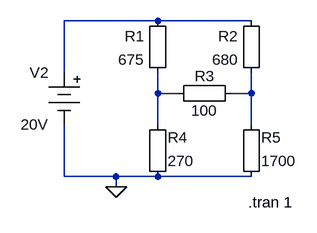
[diagram p0: schematic 313249.asc]
313249.asc, the LTspice schematic file:
Version 4
SHEET 1 880 680
WIRE 464 -80 320 -80
WIRE 608 -80 464 -80
WIRE 320 0 320 -80
WIRE 464 32 464 0
WIRE 496 32 464 32
WIRE 608 32 608 0
WIRE 608 32 576 32
WIRE 464 80 464 32
WIRE 608 80 608 32
WIRE 320 160 320 80
WIRE 400 160 320 160
WIRE 464 160 400 160
WIRE 608 160 464 160
WIRE 400 176 400 160
FLAG 400 176 0
SYMBOL Misc\\EuropeanResistor 624 -96 M0
SYMATTR InstName R2
SYMATTR Value 680
SYMBOL Misc\\EuropeanResistor 480 -96 M0
SYMATTR InstName R1
SYMATTR Value 675
SYMBOL Misc\\EuropeanResistor 480 16 M90
WINDOW 0 5 56 VBottom 2
WINDOW 3 27 56 VTop 2
SYMATTR InstName R3
SYMATTR Value 100
SYMBOL Misc\\EuropeanResistor 592 176 M180
WINDOW 0 31 76 Left 2
WINDOW 3 31 40 Left 2
SYMATTR InstName R5
SYMATTR Value 1700
SYMBOL Misc\\EuropeanResistor 448 176 M180
WINDOW 0 31 76 Left 2
WINDOW 3 31 40 Left 2
SYMATTR InstName R4
SYMATTR Value 270
SYMBOL Misc\\battery 320 -16 M0
WINDOW 123 0 0 Left 2
WINDOW 39 0 0 Left 2
SYMATTR InstName V2
SYMATTR Value 20V
TEXT 672 200 Right 2 !.tran 1

The netlist it stands for:
* 313249.asc
R2 N001 N003 680
R1 N001 N002 675
R3 N002 N003 100
R5 0 N003 1700
R4 0 N002 270
V2 N001 0 20V
.tran 1
.backanno
.end